# Altium schematic sheet MCU.SchDoc
size A3; SheetNumber: 1; SheetTotal: 8
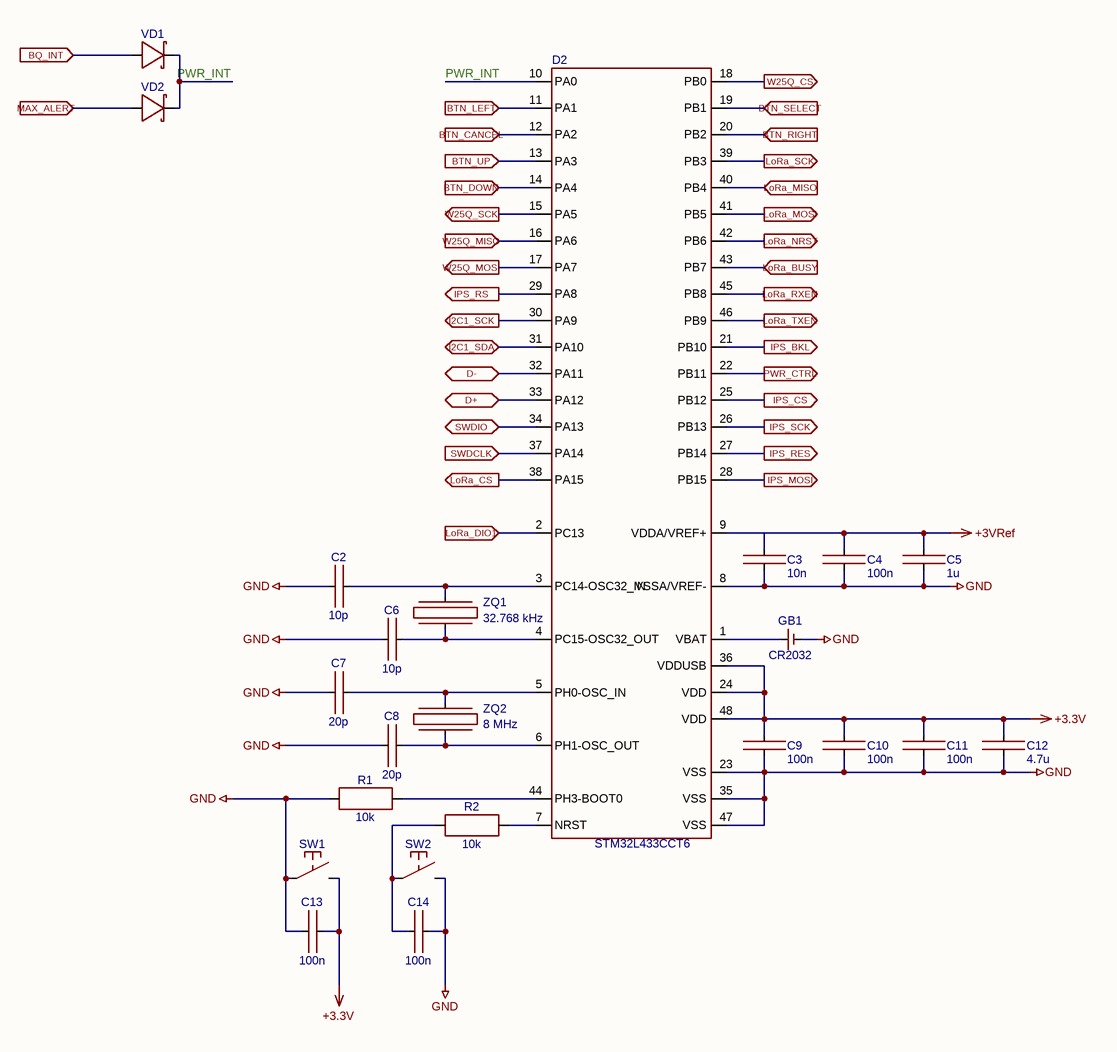
[diagram p0: MCU.SchDoc]

## Parts
C2  10p  [CAPC1608X09N]
C3  10n  [CAPC1608X09N]
C4  100n  [CAPC1608X09N]
C5  1u  [CAPC1608X09N]
C6  10p  [CAPC1608X09N]
C7  20p  [CAPC1608X09N]
C8  20p  [CAPC1608X09N]
C9  100n  [CAPC1608X09N]
C10  100n  [CAPC1608X09N]
C11  100n  [CAPC1608X09N]
C12  4.7u  [CAPC1608X09N]
C13  100n  [CAPC1608X09N]
C14  100n  [CAPC1608X09N]
D2  STM32L433CCT6  [STM LQFP-48 (5B_ME_V2)]
GB1  CR2032  [KLS5-CR2032-03]
R1  10k  [RESC2012X05N]
R2  10k  [RESC2012X05N]
SW1  FSM1SM  [FSM1SM]  (value not drawn)
SW2  FSM1SM  [FSM1SM]  (value not drawn)
VD1  BAR6402VH6327XTSA1  [INFENION SC79]  (value not drawn)
VD2  BAR6402VH6327XTSA1  [INFENION SC79]  (value not drawn)
ZQ1  32.768 kHz  [NX3215SA]
ZQ2  8 МHz  [NX5032GA]

## Ports
BQ_INT (in), BTN_CANCEL (in), BTN_DOWN (in), BTN_LEFT (in), BTN_RIGHT (in), BTN_SELECT (in), BTN_UP (in), D+ (bidir), D- (bidir), I2C1_SCK (out), I2C1_SDA (bidir), IPS_BKL (out), IPS_CS (out), IPS_MOSI (out), IPS_RES (out), IPS_RS (out), IPS_SCK (out), LoRa_BUSY (in), LoRa_CS (out), LoRa_DIO1 (in), LoRa_MISO (in), LoRa_MOSI (out), LoRa_NRST (out), LoRa_RXEN (out), LoRa_SCK (out), LoRa_TXEN (out), MAX_ALERT (in), PWR_CTRL (out), SWDCLK (in), SWDIO (bidir), W25Q_CS (out), W25Q_MISO (in), W25Q_MOSI (out), W25Q_SCK (out)

## Nets
+3.3V: C9.2 C10.2 C11.2 C12.2 C13.2 D2.24(VDD) D2.36(VDDUSB) D2.48(VDD) SW1.1
+3VRef: C3.2 C4.2 C5.2 D2.9(VDDA/VREF+)
GND: C2.1 C3.1 C4.1 C5.1 C6.1 C7.1 C8.1 C9.1 C10.1 C11.1 C12.1 C13.1 C14.2 D2.8(VSSA/VREF-) D2.23(VSS) D2.35(VSS) D2.47(VSS) GB1.0 R1.1 SW1.0 SW2.1
BQ_INT: VD1.2 ; port BQ_INT
BTN_CANCEL: D2.12(PA2) ; port BTN_CANCEL
BTN_DOWN: D2.14(PA4) ; port BTN_DOWN
BTN_LEFT: D2.11(PA1) ; port BTN_LEFT
BTN_RIGHT: D2.20(PB2) ; port BTN_RIGHT
BTN_SELECT: D2.19(PB1) ; port BTN_SELECT
BTN_UP: D2.13(PA3) ; port BTN_UP
D+: D2.33(PA12) ; port D+
D-: D2.32(PA11) ; port D-
I2C1_SCK: D2.30(PA9) ; port I2C1_SCK
I2C1_SDA: D2.31(PA10) ; port I2C1_SDA
IPS_BKL: D2.21(PB10) ; port IPS_BKL
IPS_CS: D2.25(PB12) ; port IPS_CS
IPS_MOSI: D2.28(PB15) ; port IPS_MOSI
IPS_RES: D2.27(PB14) ; port IPS_RES
IPS_RS: D2.29(PA8) ; port IPS_RS
IPS_SCK: D2.26(PB13) ; port IPS_SCK
LoRa_BUSY: D2.43(PB7) ; port LoRa_BUSY
LoRa_CS: D2.38(PA15) ; port LoRa_CS
LoRa_DIO1: D2.2(PC13) ; port LoRa_DIO1
LoRa_MISO: D2.40(PB4) ; port LoRa_MISO
LoRa_MOSI: D2.41(PB5) ; port LoRa_MOSI
LoRa_NRST: D2.42(PB6) ; port LoRa_NRST
LoRa_RXEN: D2.45(PB8) ; port LoRa_RXEN
LoRa_SCK: D2.39(PB3) ; port LoRa_SCK
LoRa_TXEN: D2.46(PB9) ; port LoRa_TXEN
MAX_ALERT: VD2.2 ; port MAX_ALERT
PWR_CTRL: D2.22(PB11) ; port PWR_CTRL
PWR_INT: D2.10(PA0) VD1.1 VD2.1
SWDCLK: D2.37(PA14) ; port SWDCLK
SWDIO: D2.34(PA13) ; port SWDIO
W25Q_CS: D2.18(PB0) ; port W25Q_CS
W25Q_MISO: D2.16(PA6) ; port W25Q_MISO
W25Q_MOSI: D2.17(PA7) ; port W25Q_MOSI
W25Q_SCK: D2.15(PA5) ; port W25Q_SCK
NetC2_2: C2.2 D2.3(PC14-OSC32_IN) ZQ1.1
NetC6_2: C6.2 D2.4(PC15-OSC32_OUT) ZQ1.0
NetC7_2: C7.2 D2.5(PH0-OSC_IN) ZQ2.1
NetC8_2: C8.2 D2.6(PH1-OSC_OUT) ZQ2.0
NetC14_1: C14.1 R2.1 SW2.0
NetD2_1: D2.1(VBAT) GB1.1
NetD2_7: D2.7(NRST) R2.2
NetD2_44: D2.44(PH3-BOOT0) R1.2

## Library data of the parts
C2 C6 = C0603-10p-50V-NPO-5%: GRM1885C1H100JA01D
C3 = C0603-10n-100V-X7R-10%: GRM188R72A103KA01D
C4 C9-C11 C13 C14 = C0603-100n-25V-X7R-10%: GRM188R71E104KA01D
C5 = C0603-1u-25V-X7R-10%: GRM188R71E105KA12D
C7 C8 = C0603-20p-50V-NPO-5%: GRM1885C1H200J
C12 = C0603-4.7u-10V-X5R-10%: GRM188R61A475K
GB1 = KLS5-CR2032-03
R1 R2 = R-0805-10k-5%
SW1 SW2 = FSM1SM: 1437566-3 (FSMSM), Кнопка тактовая h=4.6 мм SMD SPST
ZQ1 = NX3215SA: 32.768 кГц, 20ppm, 7пФ, 70кОм, -40...+85°C, SMD 3.2*1.5*0.8мм, Кварцевый резонатор
ZQ2 = NX5032GA: 8 МГц, 30/20ppm, 8пФ, -40...+85°C, SMD 5.0*3.2*1.3мм, Кварцевый резонатор